# Altium schematic sheet Telemetry.SchDoc
size A4; SheetNumber: 4; SheetTotal: 7
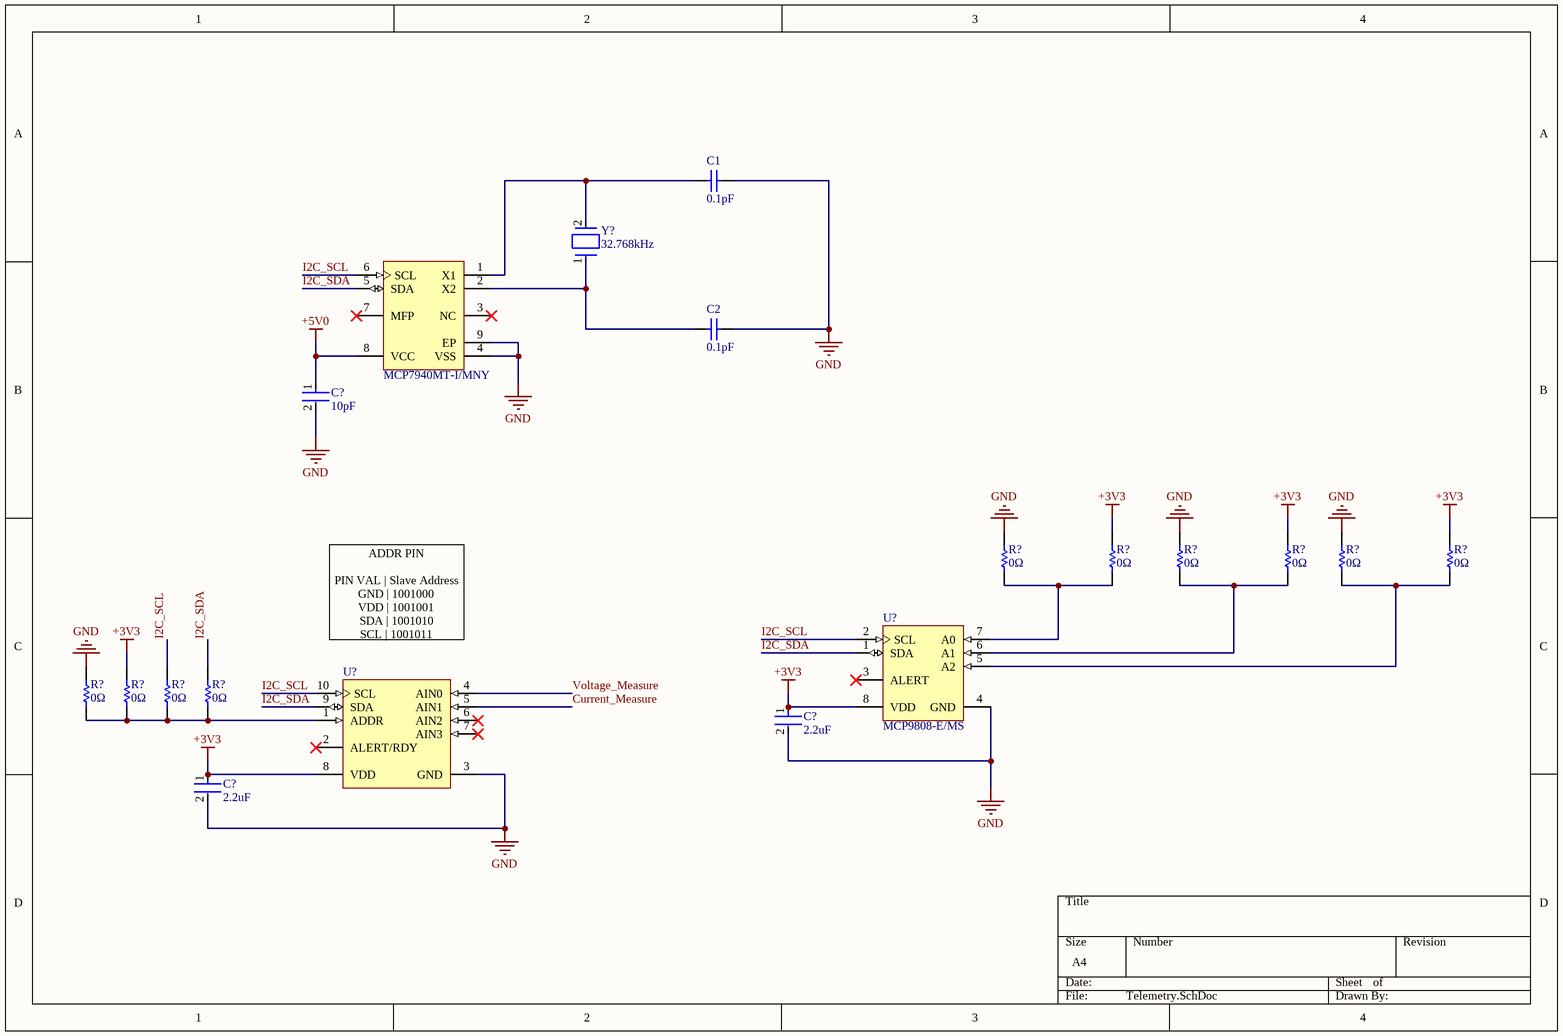
[diagram p0: Telemetry.SchDoc]

## Parts
(Parts that share a designator on the sheet are numbered #1, #2 ... from top to bottom, then left to right.)
?  MCP7940MT-I/MNY  [MCHP-TDFN-MNY8_V]
C1  0.1pF  [CAPC1508X91X25ML25T13]
C2  0.1pF  [CAPC1508X91X25ML25T13]
C?#1  10pF  [FP-C0603C-CF-MFG]
C?#2  2.2uF  [FP-GRM188-0_1-e0_2_0_5-MFG]
C?#3  2.2uF  [FP-GRM188-0_1-e0_2_0_5-MFG]
R?#1  0Ω  [RESC1005X40X25LL05T05]
R?#2  0Ω  [RESC1005X40X25LL05T05]
R?#3  0Ω  [RESC1005X40X25LL05T05]
R?#4  0Ω  [RESC1005X40X25LL05T05]
R?#5  0Ω  [RESC1005X40X25LL05T05]
R?#6  0Ω  [RESC1005X40X25LL05T05]
R?#7  0Ω  [RESC1005X40X25LL05T05]
R?#8  0Ω  [RESC1005X40X25LL05T05]
R?#9  0Ω  [RESC1005X40X25LL05T05]
R?#10  0Ω  [RESC1005X40X25LL05T05]
U?#1  MCP9808-E/MS  [MCHP-MSOP-MS8_L]
U?#2  (no value)  [TI-DGS10_M]
Y?  32.768kHz  [FP-ABS05W-MFG]

## Nets
+3V3: C?#2.1 C?#3.1 R?#2.2 R?#4.2 R?#6.2 R?#8.2 U?#1.8(VDD) U?#2.8(VDD)
+5V0: ?.8(VCC) C?#1.1
GND: ?.4(VSS) ?.9(EP) C1.2 C2.2 C?#1.2 C?#2.2 C?#3.2 R?#1.2 R?#3.2 R?#5.2 R?#7.2 U?#1.4(GND) U?#2.3(GND)
Current_Measure: U?#2.5(AIN1)
I2C_SCL: ?.6(SCL) R?#9.2 U?#1.2(SCL) U?#2.10(SCL)
I2C_SDA: ?.5(SDA) R?#10.2 U?#1.1(SDA) U?#2.9(SDA)
Voltage_Measure: U?#2.4(AIN0)
Net?_1: ?.1(X1) C1.1 Y?.2
Net?_2: ?.2(X2) C2.1 Y?.1
NetR?#1_1: R?#1.1 R?#2.1 U?#1.7(A0)
NetR?#3_1: R?#3.1 R?#4.1 U?#1.6(A1)
NetR?#5_1: R?#5.1 R?#6.1 U?#1.5(A2)
NetR?#7_1: R?#7.1 R?#8.1 R?#9.1 R?#10.1 U?#2.1(ADDR)

Not connected (* = marked no-connect by the designer): ? 3(NC)* 7(MFP)*; U?#1 3(ALERT)*; U?#2 2(ALERT/RDY)* 6(AIN2)* 7(AIN3)*

## Notes on the sheet
- ADDR PIN
  PIN VAL | Slave Address
  GND | 1001000
  VDD | 1001001
  SDA | 1001010
  SCL | 1001011

## Library data of the parts
? = CMP-0186-00324-1: Low-Cost I2C™ Real-Time Clock / Calendar with SRAM, 400 KHz Communications Speed, 64 Bytes SRAM, -40 to 85 degC, 8-pin TDFN (MNY8), Tape and Reel; Manufacturer: Microchip; ComponentLink2URL: http://ww1.microchip.com/downloads/en/DeviceDoc/22292A.pdf; ComponentLink3Description: Package Specification; Mounting Technology: Surface Mount; PackageVersion: C04-129C; ComponentLink4URL: http://www.microchip.com/MCP7940M; DatasheetVersion: Rev. A; PackageReference: TDFN-MNY8; PartNumber: MCP7940MT-I/MNY; ComponentLink4Description: Product URL; ComponentLink2Description: Datasheet; ComponentLink3URL: http://www.microchip.com/stellent/groups/techpub_sg/documents/packagingspec/en012702.pdf; PackageDescription: 8-Lead Plastic Dual Flat, 2 x 3 mm Body, 0.5 mm Pitch; ComponentLink1Description: Manufacturer URL; ComponentLink1URL: http://www.microchip.com
C1 C2 = CMP-2006-04670-1: Part Number: 06032U3R0BAT2A; Manufacturer: AVX Interconnect / Elco
C?#1 = CMP-2006-03343-2: CAP CER 10PF 50V NP0 0603; Manufacturer: KEMET; Manufacturer Part Number: C0603C100C5GACTU; Material: Ceramic; Temperature Coefficient: 30ppm/°C; Automotive Grade: Grade 1; Tolerance: 0.25 pF; Temperature Characteristic: C0G; Device Class L3: Ceramic Capacitors; Value: 10 pF; Device Class L1: Passive Components; Lead Free: Yes; RoHS: TRUE; Voltage Rating: 50 V; Automotive: Yes; Capacitance: 10 pF; Height: 0.87mm; Temperature Range Low: -55°C; Temperature Range High: +125°C; Mouser Description: Multilayer Ceramic Capacitors MLCC - SMD/SMT 50volts 10pF C0G 0.25%; Device Class L2: Capacitors; Digikey Description: CAP CER 10PF 50V NP0 0603; ComponentLink2Description: Datasheet; Package: C0603C-CF; ComponentLink2URL: https://api.kemet.com/component-edge/download/datasheet/C0603C100J5GACAUTO.pdf; Category: Cap; Octopart: https://octopart.com/c0603c100c5gactu-kemet-9138556; Temperature: -55°C to +125°C
C?#2 C?#3 = CMP-2006-02836-2: Chip Multilayer Ceramic Capacitors for General Purpose, 0603, 2.2uF, X7R, 15%, 10%, 10V; Case Code (Metric): 1608; Height: 0.8mm; Packaging: Cut Tape; Voltage: 10V; Lead Free: Lead Free; Min Operating Temperature: -55°C; Voltage Rating (DC): 10V; Max Operating Temperature: 125°C; Voltage Rating: 10V; Dielectric: X7R; Depth: 0.8mm; Case Code (Imperial): 0603; Termination: SMD/SMT; Case/Package: 0603; Number of Pins: 2; REACH SVHC: No SVHC; Mount: Surface Mount; Width: 0.031inch; Material: Ceramic; Capacitance: 2.2uF; Package Quantity: 1; Weight: 7.1E-05oz; Length: 1.6mm; Thickness: 0.035inch; Tolerance: 10%
R?#1-R?#10 = CMP-2000-07451-1: Chip Resistor, 0 Ohm, 0.1 W, -55 to 155 degC, 0402 (1005 Metric), RoHS, Tape and Reel; Manufacturer: Panasonic; Voltage Rating (DC): 50V; Temperature Coefficient: 600ppm/��C; Max Power Dissipation: 100mW; Resistance: 0mOhm; Tolerance: 5%; Number of Terminations: 2; Mount: SurfaceMount; Height: 0.35mm; Packaging: TapeandReel; Contact Plating: Tin; Manufacturer URL: http://www.panasonic.com/; Composition: ThickFilm; Max Operating Temperature: 155degC; REACH SVHC: NoSVHC; Case/Package: 0402; Package Reference: 402; Depth: 0.5mm; Package Description: 2-Pin Surface Mount Device, Body 1 x 0.5 mm; Datasheet URL: https://industrial.panasonic.com/cdbs/www-data/pdf/RDA0000/AOA0000C301.pdf; RoHSCompliant: True; Case Code (Imperial): 0402; Military Standard: Not; Min Operating Temperature: -55degC; Power Rating: 100mW; Datasheet Version: 03/2015; Length: 1mm; Case Code (Metric): 1005; Termination: SMD/SMT; Mounting Technology: SurfaceMount; Voltage Rating: 50V; Width: 0.02inch; Package Quantity: 1; Lead Free: LeadFree; Radiation Hardening: No
U?#1 = CMP-0192-00344-1: + / - 0.5 degC Maximum Accuracy Digital Temperature Sensor, 400 uA, 2.7 to 5.5 V, -40 to 125 degC, 8-pin MSOP (MS8), Tube; Manufacturer: Microchip; ComponentLink3Description: Package Specification; ComponentLink4URL: http://www.microchip.com/MCP9808; PackageDescription: 8-Lead Plastic Micro Small Outline Package, 3 x 3 mm Body, 0.65 mm Pitch; ComponentLink2Description: Datasheet; PartNumber: MCP9808-E/MS; Mounting Technology: Surface Mount; ComponentLink4Description: Product URL; ComponentLink1Description: Manufacturer URL; ComponentLink2URL: http://ww1.microchip.com/downloads/en/DeviceDoc/25095A.pdf; ComponentLink3URL: http://www.microchip.com/stellent/groups/techpub_sg/documents/packagingspec/en012702.pdf; DatasheetVersion: Rev. A; ComponentLink1URL: http://www.microchip.com; PackageReference: MSOP-MS8; PackageVersion: C04-111C
U?#2 = CMP-0003-00378-2: 16-Bit ADC with Integrated Multiplexer, PGA, Comparator, Oscillator, and Reference, -40 to 125 degC, 10-pin SOP (DGS10), Green (RoHS & no Sb/Br); PartNumber: ADS1115IDGST; Manufacturer: Texas Instruments; Sample Rate (max)(SPS): 860; SubFamily: Precision ADC (<=10MSPS); Architecture: Delta-Sigma; Digital Supply(Min)(V): 2; Resolution(Bits): 16; Digital Supply(Max)(V): 5.5; INL(Max)(+/-LSB): 1; Interface: Serial I2C; # Input Channels: 4; Eco-Plan: Green (RoHS & no Sb/Br); PackageDescription: 10-Pin Plastic Small Outline, Body 3 x 3 mm, Pitch 0.5 mm; Mounting Technology: Surface Mount; PackageReference: DGS10; DatasheetVersion: SBAS444B; ComponentLink3Description: Package Specification; ComponentLink1Description: Manufacturer URL; ComponentLink3URL: http://www.ti.com/lit/ml/mpds035b/mpds035b.pdf; ComponentLink2URL: http://www.ti.com/general/docs/lit/getliterature.tsp?genericPartNumber=ADS1115&fileType=pdf; Analog Voltage AV/DD(Min)(V): 2; ComponentLink2Description: Datasheet; PackageVersion: 4073272/C, 02/2004; Analog Voltage AV/DD(Max)(V): 5.5; Code_JEDEC: MO-153; ComponentLink1URL: http://www.ti.com/
Y? = CMP-27762-015607-1: Crystal 32.768kHz ±20ppm (Tol) 4pF 85kΩ 2-Pin SMD T/R; ESR (Equivalent Series Resistance): 85kR; Frequency Tolerance: 20ppm; Mount: Surface Mount; Load Capacitance: 4pF; Case/Package: SMD/SMT; Packaging: Cut Tape; Frequency: 32.768kHz; Series: ABS05W; Min Operating Temperature: -40°C; Max Operating Temperature: 125°C